# Altium schematic sheet Test.SchDoc
size A1
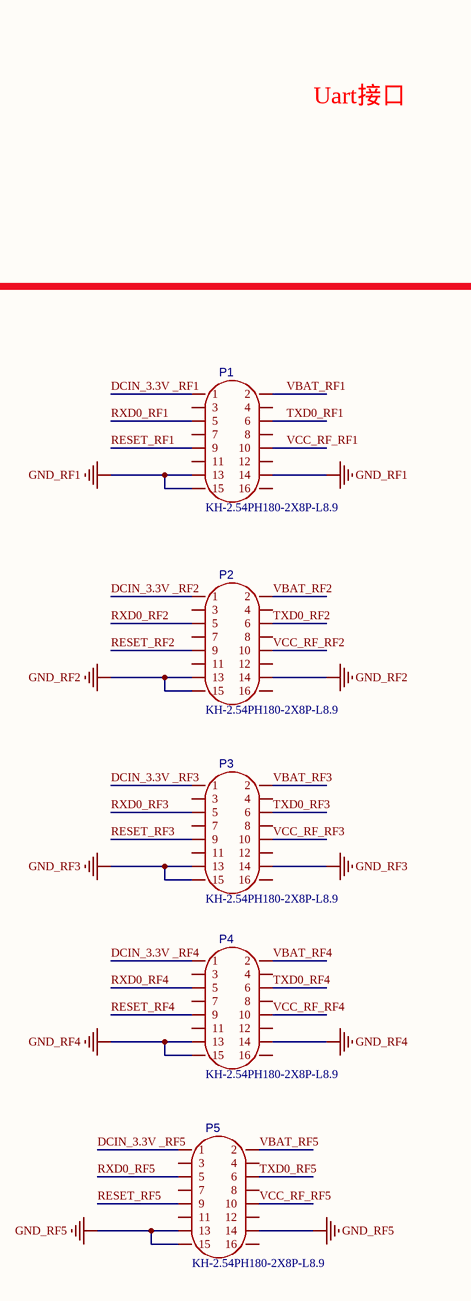
[diagram p0: Test.SchDoc, top left]
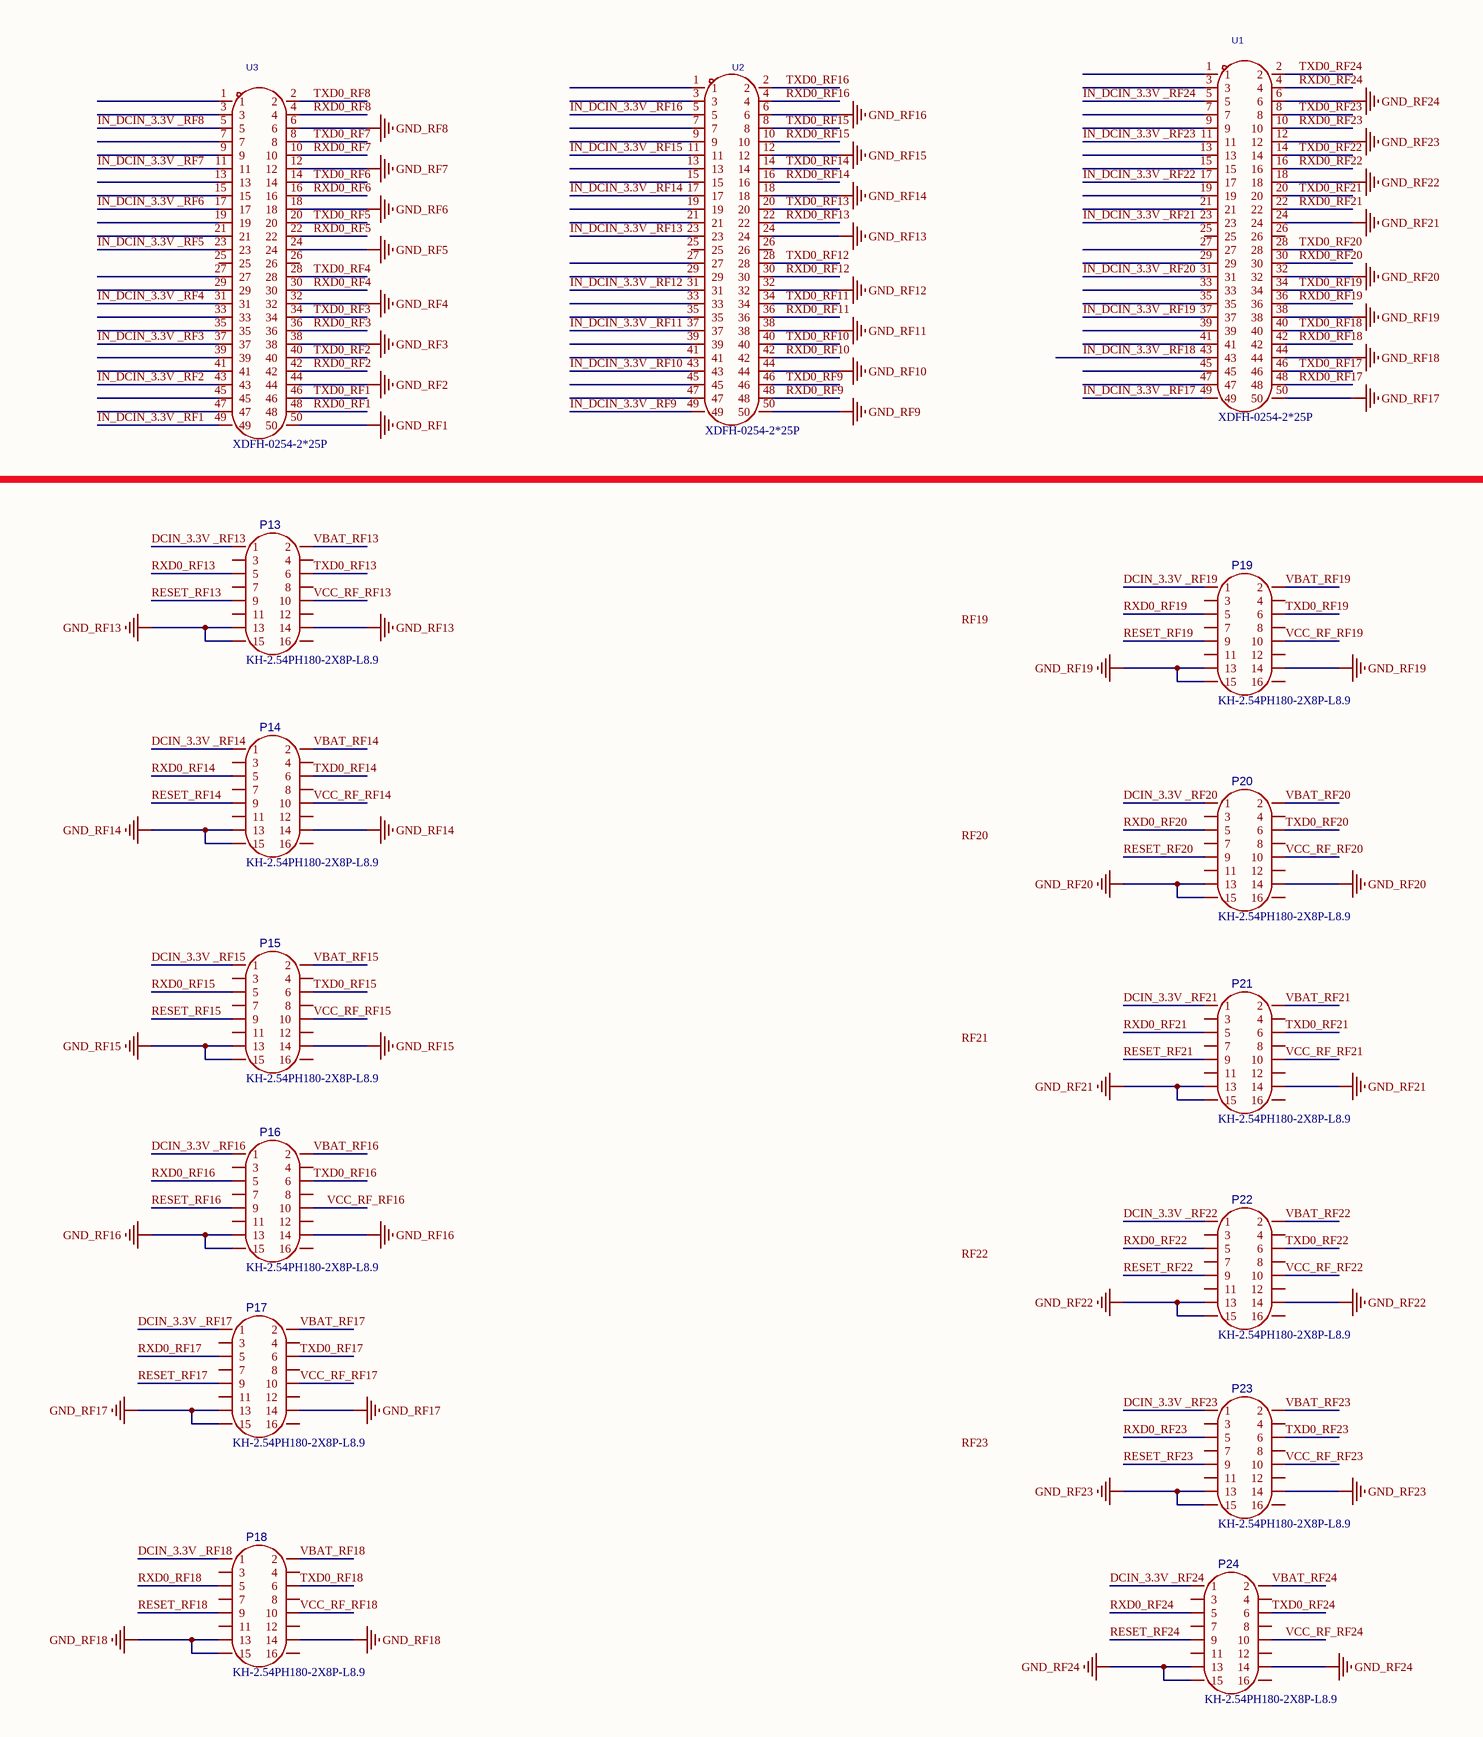
[diagram p1: Test.SchDoc, top middle]
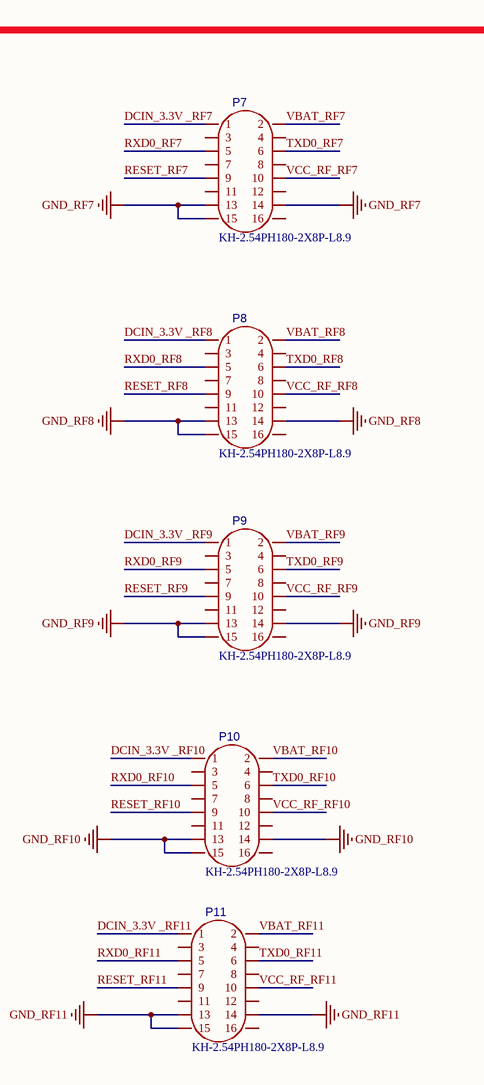
[diagram p2: Test.SchDoc, top right]
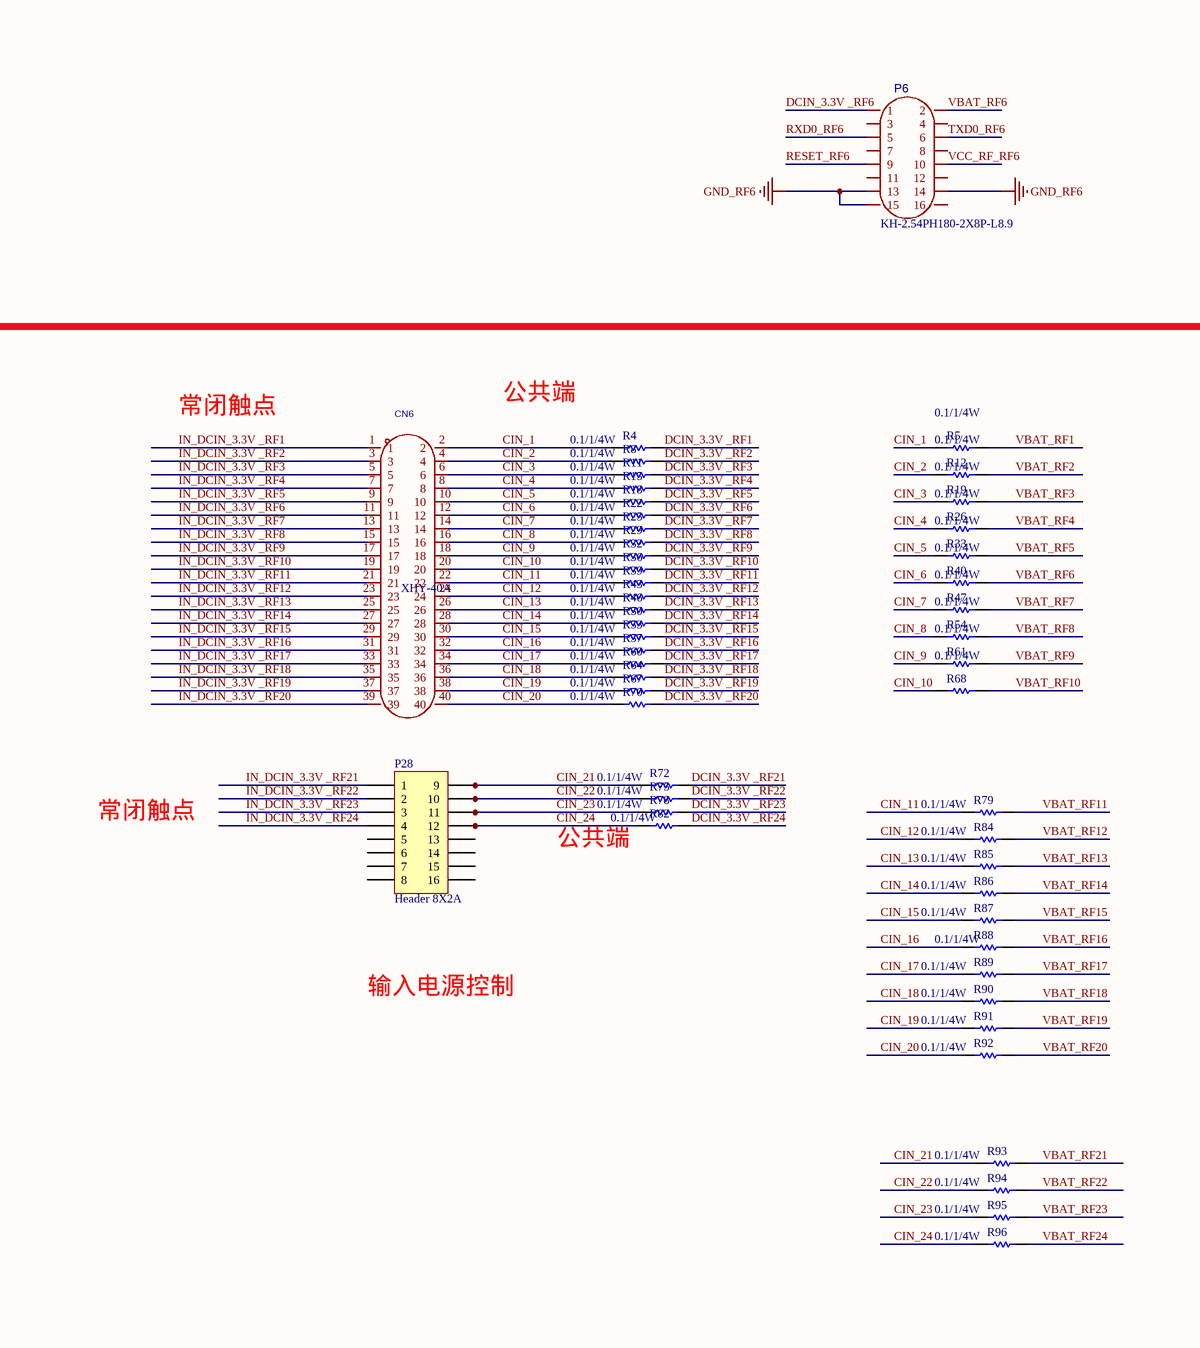
[diagram p3: Test.SchDoc, bottom left]
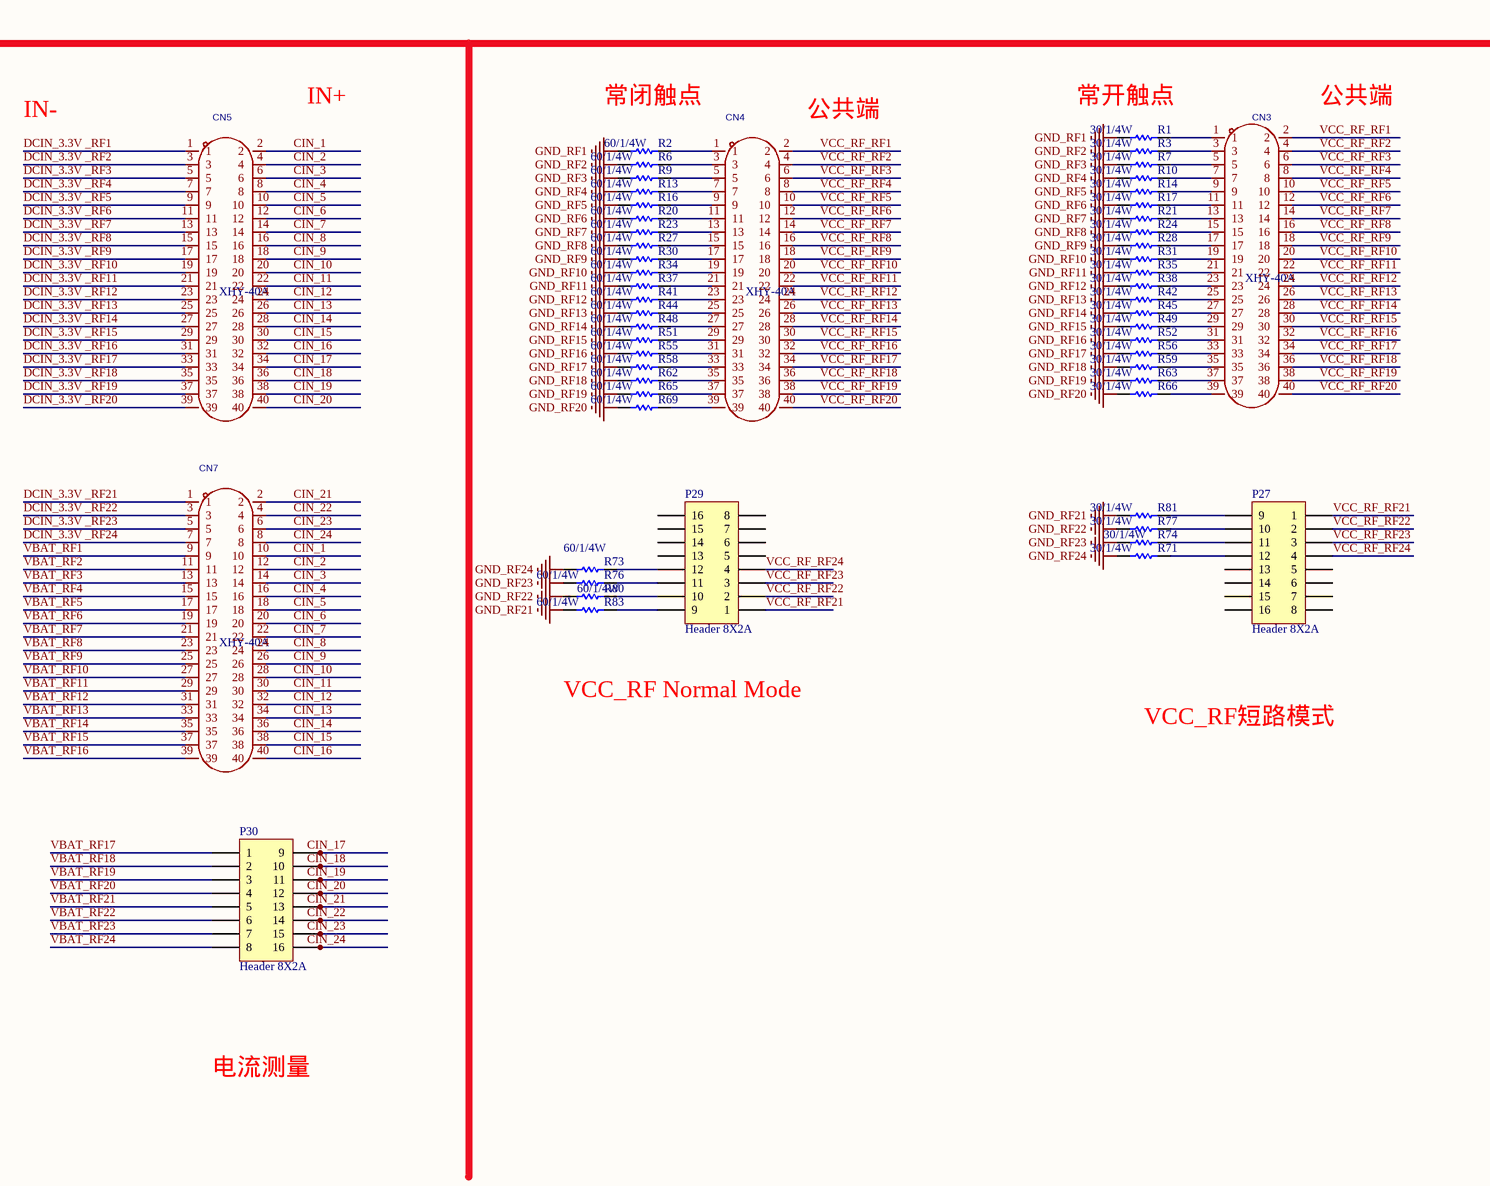
[diagram p4: Test.SchDoc, bottom middle]
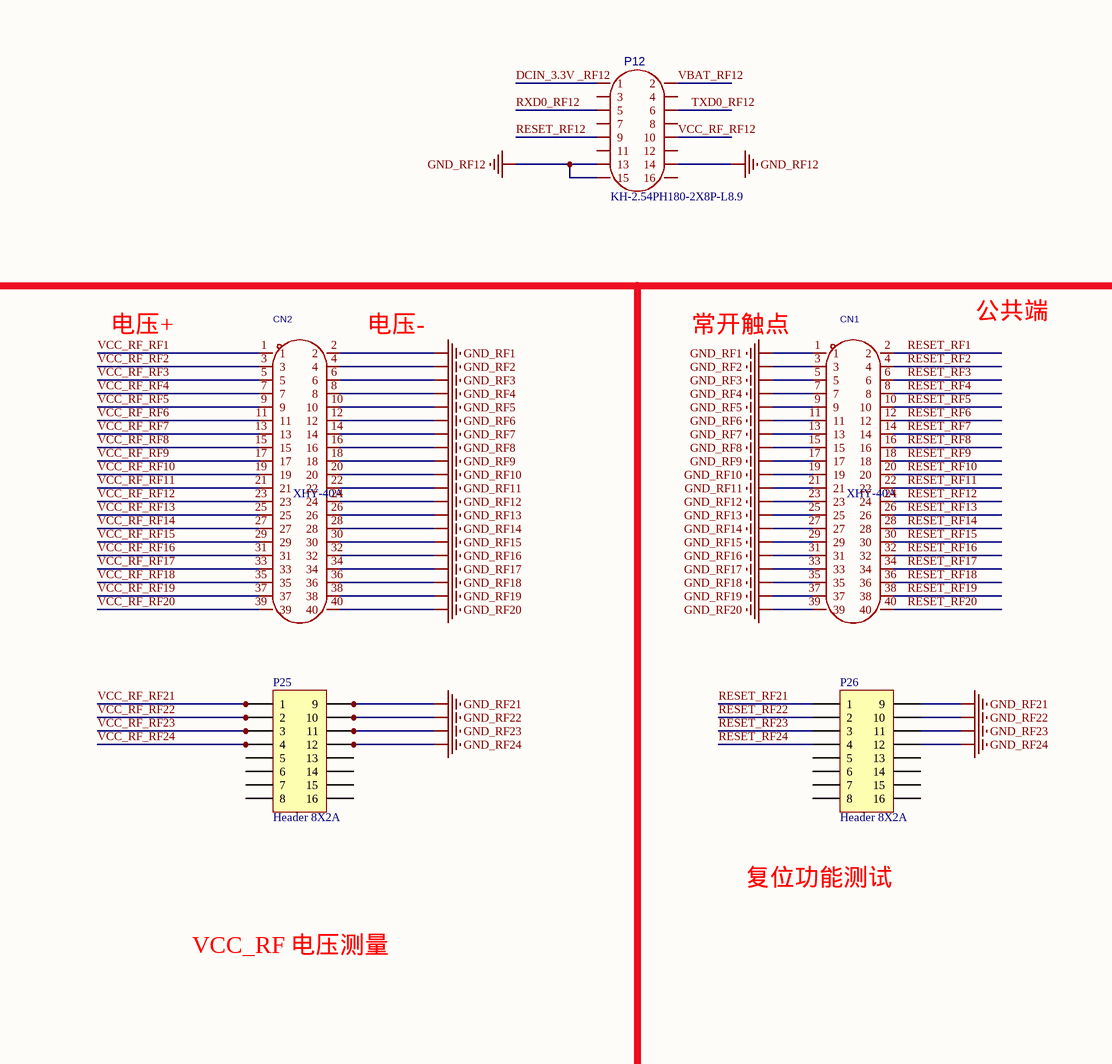
[diagram p5: Test.SchDoc, bottom right]

## Parts
CN1  XHY-40A  [CONN-TH_XHY-40A]
CN2  XHY-40A  [CONN-TH_XHY-40A]
CN3  XHY-40A  [CONN-TH_XHY-40A]
CN4  XHY-40A  [CONN-TH_XHY-40A]
CN5  XHY-40A  [CONN-TH_XHY-40A]
CN6  XHY-40A  [CONN-TH_XHY-40A]
CN7  XHY-40A  [CONN-TH_XHY-40A]
P1  KH-2.54PH180-2X8P-L8.9  [IDC-TH_16P-P2.54_C3406]
P2  KH-2.54PH180-2X8P-L8.9  [IDC-TH_16P-P2.54_C3406]
P3  KH-2.54PH180-2X8P-L8.9  [IDC-TH_16P-P2.54_C3406]
P4  KH-2.54PH180-2X8P-L8.9  [IDC-TH_16P-P2.54_C3406]
P5  KH-2.54PH180-2X8P-L8.9  [IDC-TH_16P-P2.54_C3406]
P6  KH-2.54PH180-2X8P-L8.9  [IDC-TH_16P-P2.54_C3406]
P7  KH-2.54PH180-2X8P-L8.9  [IDC-TH_16P-P2.54_C3406]
P8  KH-2.54PH180-2X8P-L8.9  [IDC-TH_16P-P2.54_C3406]
P9  KH-2.54PH180-2X8P-L8.9  [IDC-TH_16P-P2.54_C3406]
P10  KH-2.54PH180-2X8P-L8.9  [IDC-TH_16P-P2.54_C3406]
P11  KH-2.54PH180-2X8P-L8.9  [IDC-TH_16P-P2.54_C3406]
P12  KH-2.54PH180-2X8P-L8.9  [IDC-TH_16P-P2.54_C3406]
P13  KH-2.54PH180-2X8P-L8.9  [IDC-TH_16P-P2.54_C3406]
P14  KH-2.54PH180-2X8P-L8.9  [IDC-TH_16P-P2.54_C3406]
P15  KH-2.54PH180-2X8P-L8.9  [IDC-TH_16P-P2.54_C3406]
P16  KH-2.54PH180-2X8P-L8.9  [IDC-TH_16P-P2.54_C3406]
P17  KH-2.54PH180-2X8P-L8.9  [IDC-TH_16P-P2.54_C3406]
P18  KH-2.54PH180-2X8P-L8.9  [IDC-TH_16P-P2.54_C3406]
P19  KH-2.54PH180-2X8P-L8.9  [IDC-TH_16P-P2.54_C3406]
P20  KH-2.54PH180-2X8P-L8.9  [IDC-TH_16P-P2.54_C3406]
P21  KH-2.54PH180-2X8P-L8.9  [IDC-TH_16P-P2.54_C3406]
P22  KH-2.54PH180-2X8P-L8.9  [IDC-TH_16P-P2.54_C3406]
P23  KH-2.54PH180-2X8P-L8.9  [IDC-TH_16P-P2.54_C3406]
P24  KH-2.54PH180-2X8P-L8.9  [IDC-TH_16P-P2.54_C3406]
P25  Header 8X2A  [HDR2X8_CEN]
P26  Header 8X2A  [HDR2X8_CEN]
P27  Header 8X2A  [HDR2X8_CEN]
P28  Header 8X2A  [HDR2X8_CEN]
P29  Header 8X2A  [HDR2X8_CEN]
P30  Header 8X2A  [HDR2X8_CEN]
R1  30/1/4W  [1206R]
R2  60/1/4W  [1206R]
R3  30/1/4W  [1206R]
R4  0.1/1/4W  [1206R]
R5  0.1/1/4W  [1206R]
R6  60/1/4W  [1206R]
R7  30/1/4W  [1206R]
R8  0.1/1/4W  [1206R]
R9  60/1/4W  [1206R]
R10  30/1/4W  [1206R]
R11  0.1/1/4W  [1206R]
R12  0.1/1/4W  [1206R]
R13  60/1/4W  [1206R]
R14  30/1/4W  [1206R]
R15  0.1/1/4W  [1206R]
R16  60/1/4W  [1206R]
R17  30/1/4W  [1206R]
R18  0.1/1/4W  [1206R]
R19  0.1/1/4W  [1206R]
R20  60/1/4W  [1206R]
R21  30/1/4W  [1206R]
R22  0.1/1/4W  [1206R]
R23  60/1/4W  [1206R]
R24  30/1/4W  [1206R]
R25  0.1/1/4W  [1206R]
R26  0.1/1/4W  [1206R]
R27  60/1/4W  [1206R]
R28  30/1/4W  [1206R]
R29  0.1/1/4W  [1206R]
R30  60/1/4W  [1206R]
R31  30/1/4W  [1206R]
R32  0.1/1/4W  [1206R]
R33  0.1/1/4W  [1206R]
R34  60/1/4W  [1206R]
R35  30/1/4W  [1206R]
R36  0.1/1/4W  [1206R]
R37  60/1/4W  [1206R]
R38  30/1/4W  [1206R]
R39  0.1/1/4W  [1206R]
R40  0.1/1/4W  [1206R]
R41  60/1/4W  [1206R]
R42  30/1/4W  [1206R]
R43  0.1/1/4W  [1206R]
R44  60/1/4W  [1206R]
R45  30/1/4W  [1206R]
R46  0.1/1/4W  [1206R]
R47  0.1/1/4W  [1206R]
R48  60/1/4W  [1206R]
R49  30/1/4W  [1206R]
R50  0.1/1/4W  [1206R]
R51  60/1/4W  [1206R]
R52  30/1/4W  [1206R]
R53  0.1/1/4W  [1206R]
R54  0.1/1/4W  [1206R]
R55  60/1/4W  [1206R]
R56  30/1/4W  [1206R]
R57  0.1/1/4W  [1206R]
R58  60/1/4W  [1206R]
R59  30/1/4W  [1206R]
R60  0.1/1/4W  [1206R]
R61  0.1/1/4W  [1206R]
R62  60/1/4W  [1206R]
R63  30/1/4W  [1206R]
R64  0.1/1/4W  [1206R]
R65  60/1/4W  [1206R]
R66  30/1/4W  [1206R]
R67  0.1/1/4W  [1206R]
R68  0.1/1/4W  [1206R]
R69  60/1/4W  [1206R]
R70  0.1/1/4W  [1206R]
R71  30/1/4W  [1206R]
R72  0.1/1/4W  [1206R]
R73  60/1/4W  [1206R]
R74  30/1/4W  [1206R]
R75  0.1/1/4W  [1206R]
R76  60/1/4W  [1206R]
R77  30/1/4W  [1206R]
R78  0.1/1/4W  [1206R]
R79  0.1/1/4W  [1206R]
R80  60/1/4W  [1206R]
R81  30/1/4W  [1206R]
R82  0.1/1/4W  [1206R]
R83  60/1/4W  [1206R]
R84  0.1/1/4W  [1206R]
R85  0.1/1/4W  [1206R]
R86  0.1/1/4W  [1206R]
R87  0.1/1/4W  [1206R]
R88  0.1/1/4W  [1206R]
R89  0.1/1/4W  [1206R]
R90  0.1/1/4W  [1206R]
R91  0.1/1/4W  [1206R]
R92  0.1/1/4W  [1206R]
R93  0.1/1/4W  [1206R]
R94  0.1/1/4W  [1206R]
R95  0.1/1/4W  [1206R]
R96  0.1/1/4W  [1206R]
U1  XDFH-0254-2*25P  [CONN-TH_50P-P2.54_LX_XDFH-0254-2X25P]
U2  XDFH-0254-2*25P  [CONN-TH_50P-P2.54_LX_XDFH-0254-2X25P]
U3  XDFH-0254-2*25P  [CONN-TH_50P-P2.54_LX_XDFH-0254-2X25P]

## Nets
GND_RF1: CN1.1 CN2.2 P1.13 P1.14 P1.15 R1.1 R2.1 U3.50
GND_RF2: CN1.3 CN2.4 P2.13 P2.14 P2.15 R3.1 R6.1 U3.44
GND_RF3: CN1.5 CN2.6 P3.13 P3.14 P3.15 R7.1 R9.1 U3.38
GND_RF4: CN1.7 CN2.8 P4.13 P4.14 P4.15 R10.1 R13.1 U3.32
GND_RF5: CN1.9 CN2.10 P5.13 P5.14 P5.15 R14.1 R16.1 U3.24
GND_RF6: CN1.11 CN2.12 P6.13 P6.14 P6.15 R17.1 R20.1 U3.18
GND_RF7: CN1.13 CN2.14 P7.13 P7.14 P7.15 R21.1 R23.1 U3.12
GND_RF8: CN1.15 CN2.16 P8.13 P8.14 P8.15 R24.1 R27.1 U3.6
GND_RF9: CN1.17 CN2.18 P9.13 P9.14 P9.15 R28.1 R30.1 U2.50
GND_RF10: CN1.19 CN2.20 P10.13 P10.14 P10.15 R31.1 R34.1 U2.44
GND_RF11: CN1.21 CN2.22 P11.13 P11.14 P11.15 R35.1 R37.1 U2.38
GND_RF12: CN1.23 CN2.24 P12.13 P12.14 P12.15 R38.1 R41.1 U2.32
GND_RF13: CN1.25 CN2.26 P13.13 P13.14 P13.15 R42.1 R44.1 U2.24
GND_RF14: CN1.27 CN2.28 P14.13 P14.14 P14.15 R45.1 R48.1 U2.18
GND_RF15: CN1.29 CN2.30 P15.13 P15.14 P15.15 R49.1 R51.1 U2.12
GND_RF16: CN1.31 CN2.32 P16.13 P16.14 P16.15 R52.1 R55.1 U2.6
GND_RF17: CN1.33 CN2.34 P17.13 P17.14 P17.15 R56.1 R58.1 U1.50
GND_RF18: CN1.35 CN2.36 P18.13 P18.14 P18.15 R59.1 R62.1 U1.44
GND_RF19: CN1.37 CN2.38 P19.13 P19.14 P19.15 R63.1 R65.1 U1.38
GND_RF20: CN1.39 CN2.40 P20.13 P20.14 P20.15 R66.1 R69.1 U1.32
GND_RF21: P21.13 P21.14 P21.15 P25.9 P26.9 R81.1 R83.1 U1.24
GND_RF22: P22.13 P22.14 P22.15 P25.10 P26.10 R77.1 R80.1 U1.18
GND_RF23: P23.13 P23.14 P23.15 P25.11 P26.11 R74.1 R76.1 U1.12
GND_RF24: P24.13 P24.14 P24.15 P25.12 P26.12 R71.1 R73.1 U1.6
CIN_1: CN5.2 CN6.2 CN7.10 R4.1 R5.1
CIN_2: CN5.4 CN6.4 CN7.12 R8.1 R12.1
CIN_3: CN5.6 CN6.6 CN7.14 R11.1 R19.1
CIN_4: CN5.8 CN6.8 CN7.16 R15.1 R26.1
CIN_5: CN5.10 CN6.10 CN7.18 R18.1 R33.1
CIN_6: CN5.12 CN6.12 CN7.20 R22.1 R40.1
CIN_7: CN5.14 CN6.14 CN7.22 R25.1 R47.1
CIN_8: CN5.16 CN6.16 CN7.24 R29.1 R54.1
CIN_9: CN5.18 CN6.18 CN7.26 R32.1 R61.1
CIN_10: CN5.20 CN6.20 CN7.28 R36.1 R68.1
CIN_11: CN5.22 CN6.22 CN7.30 R39.1 R79.1
CIN_12: CN5.24 CN6.24 CN7.32 R43.1 R84.1
CIN_13: CN5.26 CN6.26 CN7.34 R46.1 R85.1
CIN_14: CN5.28 CN6.28 CN7.36 R50.1 R86.1
CIN_15: CN5.30 CN6.30 CN7.38 R53.1 R87.1
CIN_16: CN5.32 CN6.32 CN7.40 R57.1 R88.1
CIN_17: CN5.34 CN6.34 P30.9 R60.1 R89.1
CIN_18: CN5.36 CN6.36 P30.10 R64.1 R90.1
CIN_19: CN5.38 CN6.38 P30.11 R67.1 R91.1
CIN_20: CN5.40 CN6.40 P30.12 R70.1 R92.1
CIN_21: CN7.2 P28.9 P30.13 R72.1 R93.1
CIN_22: CN7.4 P28.10 P30.14 R75.1 R94.1
CIN_23: CN7.6 P28.11 P30.15 R78.1 R95.1
CIN_24: CN7.8 P28.12 P30.16 R82.1 R96.1
DCIN_3.3V _RF1: CN5.1 P1.1 R4.2
DCIN_3.3V _RF2: CN5.3 P2.1 R8.2
DCIN_3.3V _RF3: CN5.5 P3.1 R11.2
DCIN_3.3V _RF4: CN5.7 P4.1 R15.2
DCIN_3.3V _RF5: CN5.9 P5.1 R18.2
DCIN_3.3V _RF6: CN5.11 P6.1 R22.2
DCIN_3.3V _RF7: CN5.13 P7.1 R25.2
DCIN_3.3V _RF8: CN5.15 P8.1 R29.2
DCIN_3.3V _RF9: CN5.17 P9.1 R32.2
DCIN_3.3V _RF10: CN5.19 P10.1 R36.2
DCIN_3.3V _RF11: CN5.21 P11.1 R39.2
DCIN_3.3V _RF12: CN5.23 P12.1 R43.2
DCIN_3.3V _RF13: CN5.25 P13.1 R46.2
DCIN_3.3V _RF14: CN5.27 P14.1 R50.2
DCIN_3.3V _RF15: CN5.29 P15.1 R53.2
DCIN_3.3V _RF16: CN5.31 P16.1 R57.2
DCIN_3.3V _RF17: CN5.33 P17.1 R60.2
DCIN_3.3V _RF18: CN5.35 P18.1 R64.2
DCIN_3.3V _RF19: CN5.37 P19.1 R67.2
DCIN_3.3V _RF20: CN5.39 P20.1 R70.2
DCIN_3.3V _RF21: CN7.1 P21.1 R72.2
DCIN_3.3V _RF22: CN7.3 P22.1 R75.2
DCIN_3.3V _RF23: CN7.5 P23.1 R78.2
DCIN_3.3V _RF24: CN7.7 P24.1 R82.2
IN_DCIN_3.3V _RF1: CN6.1 U3.49
IN_DCIN_3.3V _RF2: CN6.3 U3.43
IN_DCIN_3.3V _RF3: CN6.5 U3.37
IN_DCIN_3.3V _RF4: CN6.7 U3.31
IN_DCIN_3.3V _RF5: CN6.9 U3.23
IN_DCIN_3.3V _RF6: CN6.11 U3.17
IN_DCIN_3.3V _RF7: CN6.13 U3.11
IN_DCIN_3.3V _RF8: CN6.15 U3.5
IN_DCIN_3.3V _RF9: CN6.17 U2.49
IN_DCIN_3.3V _RF10: CN6.19 U2.43
IN_DCIN_3.3V _RF11: CN6.21 U2.37
IN_DCIN_3.3V _RF12: CN6.23 U2.31
IN_DCIN_3.3V _RF13: CN6.25 U2.23
IN_DCIN_3.3V _RF14: CN6.27 U2.17
IN_DCIN_3.3V _RF15: CN6.29 U2.11
IN_DCIN_3.3V _RF16: CN6.31 U2.5
IN_DCIN_3.3V _RF17: CN6.33 U1.49
IN_DCIN_3.3V _RF18: CN6.35 U1.43
IN_DCIN_3.3V _RF19: CN6.37 U1.37
IN_DCIN_3.3V _RF20: CN6.39 U1.31
IN_DCIN_3.3V _RF21: P28.1 U1.23
IN_DCIN_3.3V _RF22: P28.2 U1.17
IN_DCIN_3.3V _RF23: P28.3 U1.11
IN_DCIN_3.3V _RF24: P28.4 U1.5
RESET_RF1: CN1.2 P1.9
RESET_RF2: CN1.4 P2.9
RESET_RF3: CN1.6 P3.9
RESET_RF4: CN1.8 P4.9
RESET_RF5: CN1.10 P5.9
RESET_RF6: CN1.12 P6.9
RESET_RF7: CN1.14 P7.9
RESET_RF8: CN1.16 P8.9
RESET_RF9: CN1.18 P9.9
RESET_RF10: CN1.20 P10.9
RESET_RF11: CN1.22 P11.9
RESET_RF12: CN1.24 P12.9
RESET_RF13: CN1.26 P13.9
RESET_RF14: CN1.28 P14.9
RESET_RF15: CN1.30 P15.9
RESET_RF16: CN1.32 P16.9
RESET_RF17: CN1.34 P17.9
RESET_RF18: CN1.36 P18.9
RESET_RF19: CN1.38 P19.9
RESET_RF20: CN1.40 P20.9
RESET_RF21: P21.9 P26.1
RESET_RF22: P22.9 P26.2
RESET_RF23: P23.9 P26.3
RESET_RF24: P24.9 P26.4
RXD0_RF1: P1.5 U3.48
RXD0_RF2: P2.5 U3.42
RXD0_RF3: P3.5 U3.36
RXD0_RF4: P4.5 U3.30
RXD0_RF5: P5.5 U3.22
RXD0_RF6: P6.5 U3.16
RXD0_RF7: P7.5 U3.10
RXD0_RF8: P8.5 U3.4
RXD0_RF9: P9.5 U2.48
RXD0_RF10: P10.5 U2.42
RXD0_RF11: P11.5 U2.36
RXD0_RF12: P12.5 U2.30
RXD0_RF13: P13.5 U2.22
RXD0_RF14: P14.5 U2.16
RXD0_RF15: P15.5 U2.10
RXD0_RF16: P16.5 U2.4
RXD0_RF17: P17.5 U1.48
RXD0_RF18: P18.5 U1.42
RXD0_RF19: P19.5 U1.36
RXD0_RF20: P20.5 U1.30
RXD0_RF21: P21.5 U1.22
RXD0_RF22: P22.5 U1.16
RXD0_RF23: P23.5 U1.10
RXD0_RF24: P24.5 U1.4
TXD0_RF1: P1.6 U3.46
TXD0_RF2: P2.6 U3.40
TXD0_RF3: P3.6 U3.34
TXD0_RF4: P4.6 U3.28
TXD0_RF5: P5.6 U3.20
TXD0_RF6: P6.6 U3.14
TXD0_RF7: P7.6 U3.8
TXD0_RF8: P8.6 U3.2
TXD0_RF9: P9.6 U2.46
TXD0_RF10: P10.6 U2.40
TXD0_RF11: P11.6 U2.34
TXD0_RF12: P12.6 U2.28
TXD0_RF13: P13.6 U2.20
TXD0_RF14: P14.6 U2.14
TXD0_RF15: P15.6 U2.8
TXD0_RF16: P16.6 U2.2
TXD0_RF17: P17.6 U1.46
TXD0_RF18: P18.6 U1.40
TXD0_RF19: P19.6 U1.34
TXD0_RF20: P20.6 U1.28
TXD0_RF21: P21.6 U1.20
TXD0_RF22: P22.6 U1.14
TXD0_RF23: P23.6 U1.8
TXD0_RF24: P24.6 U1.2
VBAT_RF1: CN7.9 P1.2 R5.2
VBAT_RF2: CN7.11 P2.2 R12.2
VBAT_RF3: CN7.13 P3.2 R19.2
VBAT_RF4: CN7.15 P4.2 R26.2
VBAT_RF5: CN7.17 P5.2 R33.2
VBAT_RF6: CN7.19 P6.2 R40.2
VBAT_RF7: CN7.21 P7.2 R47.2
VBAT_RF8: CN7.23 P8.2 R54.2
VBAT_RF9: CN7.25 P9.2 R61.2
VBAT_RF10: CN7.27 P10.2 R68.2
VBAT_RF11: CN7.29 P11.2 R79.2
VBAT_RF12: CN7.31 P12.2 R84.2
VBAT_RF13: CN7.33 P13.2 R85.2
VBAT_RF14: CN7.35 P14.2 R86.2
VBAT_RF15: CN7.37 P15.2 R87.2
VBAT_RF16: CN7.39 P16.2 R88.2
VBAT_RF17: P17.2 P30.1 R89.2
VBAT_RF18: P18.2 P30.2 R90.2
VBAT_RF19: P19.2 P30.3 R91.2
VBAT_RF20: P20.2 P30.4 R92.2
VBAT_RF21: P21.2 P30.5 R93.2
VBAT_RF22: P22.2 P30.6 R94.2
VBAT_RF23: P23.2 P30.7 R95.2
VBAT_RF24: P24.2 P30.8 R96.2
VCC_RF_RF1: CN2.1 CN3.2 CN4.2 P1.10
VCC_RF_RF2: CN2.3 CN3.4 CN4.4 P2.10
VCC_RF_RF3: CN2.5 CN3.6 CN4.6 P3.10
VCC_RF_RF4: CN2.7 CN3.8 CN4.8 P4.10
VCC_RF_RF5: CN2.9 CN3.10 CN4.10 P5.10
VCC_RF_RF6: CN2.11 CN3.12 CN4.12 P6.10
VCC_RF_RF7: CN2.13 CN3.14 CN4.14 P7.10
VCC_RF_RF8: CN2.15 CN3.16 CN4.16 P8.10
VCC_RF_RF9: CN2.17 CN3.18 CN4.18 P9.10
VCC_RF_RF10: CN2.19 CN3.20 CN4.20 P10.10
VCC_RF_RF11: CN2.21 CN3.22 CN4.22 P11.10
VCC_RF_RF12: CN2.23 CN3.24 CN4.24 P12.10
VCC_RF_RF13: CN2.25 CN3.26 CN4.26 P13.10
VCC_RF_RF14: CN2.27 CN3.28 CN4.28 P14.10
VCC_RF_RF15: CN2.29 CN3.30 CN4.30 P15.10
VCC_RF_RF16: CN2.31 CN3.32 CN4.32 P16.10
VCC_RF_RF17: CN2.33 CN3.34 CN4.34 P17.10
VCC_RF_RF18: CN2.35 CN3.36 CN4.36 P18.10
VCC_RF_RF19: CN2.37 CN3.38 CN4.38 P19.10
VCC_RF_RF20: CN2.39 CN3.40 CN4.40 P20.10
VCC_RF_RF21: P21.10 P25.1 P27.1 P29.1
VCC_RF_RF22: P22.10 P25.2 P27.2 P29.2
VCC_RF_RF23: P23.10 P25.3 P27.3 P29.3
VCC_RF_RF24: P24.10 P25.4 P27.4 P29.4
NetCN3_1: CN3.1 R1.2
NetCN3_3: CN3.3 R3.2
NetCN3_5: CN3.5 R7.2
NetCN3_7: CN3.7 R10.2
NetCN3_9: CN3.9 R14.2
NetCN3_11: CN3.11 R17.2
NetCN3_13: CN3.13 R21.2
NetCN3_15: CN3.15 R24.2
NetCN3_17: CN3.17 R28.2
NetCN3_19: CN3.19 R31.2
NetCN3_21: CN3.21 R35.2
NetCN3_23: CN3.23 R38.2
NetCN3_25: CN3.25 R42.2
NetCN3_27: CN3.27 R45.2
NetCN3_29: CN3.29 R49.2
NetCN3_31: CN3.31 R52.2
NetCN3_33: CN3.33 R56.2
NetCN3_35: CN3.35 R59.2
NetCN3_37: CN3.37 R63.2
NetCN3_39: CN3.39 R66.2
NetCN4_1: CN4.1 R2.2
NetCN4_3: CN4.3 R6.2
NetCN4_5: CN4.5 R9.2
NetCN4_7: CN4.7 R13.2
NetCN4_9: CN4.9 R16.2
NetCN4_11: CN4.11 R20.2
NetCN4_13: CN4.13 R23.2
NetCN4_15: CN4.15 R27.2
NetCN4_17: CN4.17 R30.2
NetCN4_19: CN4.19 R34.2
NetCN4_21: CN4.21 R37.2
NetCN4_23: CN4.23 R41.2
NetCN4_25: CN4.25 R44.2
NetCN4_27: CN4.27 R48.2
NetCN4_29: CN4.29 R51.2
NetCN4_31: CN4.31 R55.2
NetCN4_33: CN4.33 R58.2
NetCN4_35: CN4.35 R62.2
NetCN4_37: CN4.37 R65.2
NetCN4_39: CN4.39 R69.2
NetP27_9: P27.9 R81.2
NetP27_10: P27.10 R77.2
NetP27_11: P27.11 R74.2
NetP27_12: P27.12 R71.2
NetP29_9: P29.9 R83.2
NetP29_10: P29.10 R80.2
NetP29_11: P29.11 R76.2
NetP29_12: P29.12 R73.2

Not connected (* = marked no-connect by the designer): P1 3 4 7 8 11 12 16; P2 3 4 7 8 11 12 16; P3 3 4 7 8 11 12 16; P4 3 4 7 8 11 12 16; P5 3 4 7 8 11 12 16; P6 3 4 7 8 11 12 16; P7 3 4 7 8 11 12 16; P8 3 4 7 8 11 12 16; P9 3 4 7 8 11 12 16; P10 3 4 7 8 11 12 16; P11 3 4 7 8 11 12 16; P12 3 4 7 8 11 12 16; P13 3 4 7 8 11 12 16; P14 3 4 7 8 11 12 16; P15 3 4 7 8 11 12 16; P16 3 4 7 8 11 12 16; P17 3 4 7 8 11 12 16; P18 3 4 7 8 11 12 16; P19 3 4 7 8 11 12 16; P20 3 4 7 8 11 12 16; P21 3 4 7 8 11 12 16; P22 3 4 7 8 11 12 16; P23 3 4 7 8 11 12 16; P24 3 4 7 8 11 12 16; P25 5 6 7 8 13 14 15 16; P26 5 6 7 8 13 14 15 16; P27 5 6 7 8 13 14 15 16; P28 5 6 7 8 13 14 15 16; P29 5 6 7 8 13 14 15 16; U1 1 3 7 9 13 15 19 21 25 26 27 29 33 35 39 41 45 47; U2 1 3 7 9 13 15 19 21 25 26 27 29 33 35 39 41 45 47; U3 1 3 7 9 13 15 19 21 25 26 27 29 33 35 39 41 45 47

## Notes on the sheet
- Uart接口
- 电压+
- (near CN2) 电压-
- 常开触点
- 公共端
- 常闭触点
- IN-
- IN+
- (near CN4) 公共端
- (near CN3) 公共端
- VCC_RF Normal Mode
- 复位功能测试
- 输入电源控制
- VCC_RF短路模式
- VCC_RF 电压测量
- 电流测量
- Labels drawn without touching a wire or pin: RF19, RF20, RF21, RF22, RF23

## Library data of the parts
P1-P24 = HDR-IDC-2.54-2X8P: Symbol: HDR-IDC-2.54-2X8P
P25-P30 = Header 8X2A: Header, 8-Pin, Dual row; LatestRevisionDate: 17-Jul-2002; LatestRevisionNote: Re-released for DXP Platform.; Publisher: Altium Limited
R1-R96 = Res1: Resistor; Published: 8-Jun-2000; LatestRevisionDate: 17-Jul-2002; LatestRevisionNote: Re-released for DXP Platform.; PackageReference: AXIAL-0.3; Publisher: Altium Limited
U1-U3 = XDFH-0254- 2*25P: Symbol: XDFH-0254- 2*25P
CN1-CN7 = XHY-40A: Symbol: XHY-40A